# Altium schematic sheet TDS sensor 1.SchDoc
size A4; DocumentNumber: 4; SheetNumber: 4; SheetTotal: 4
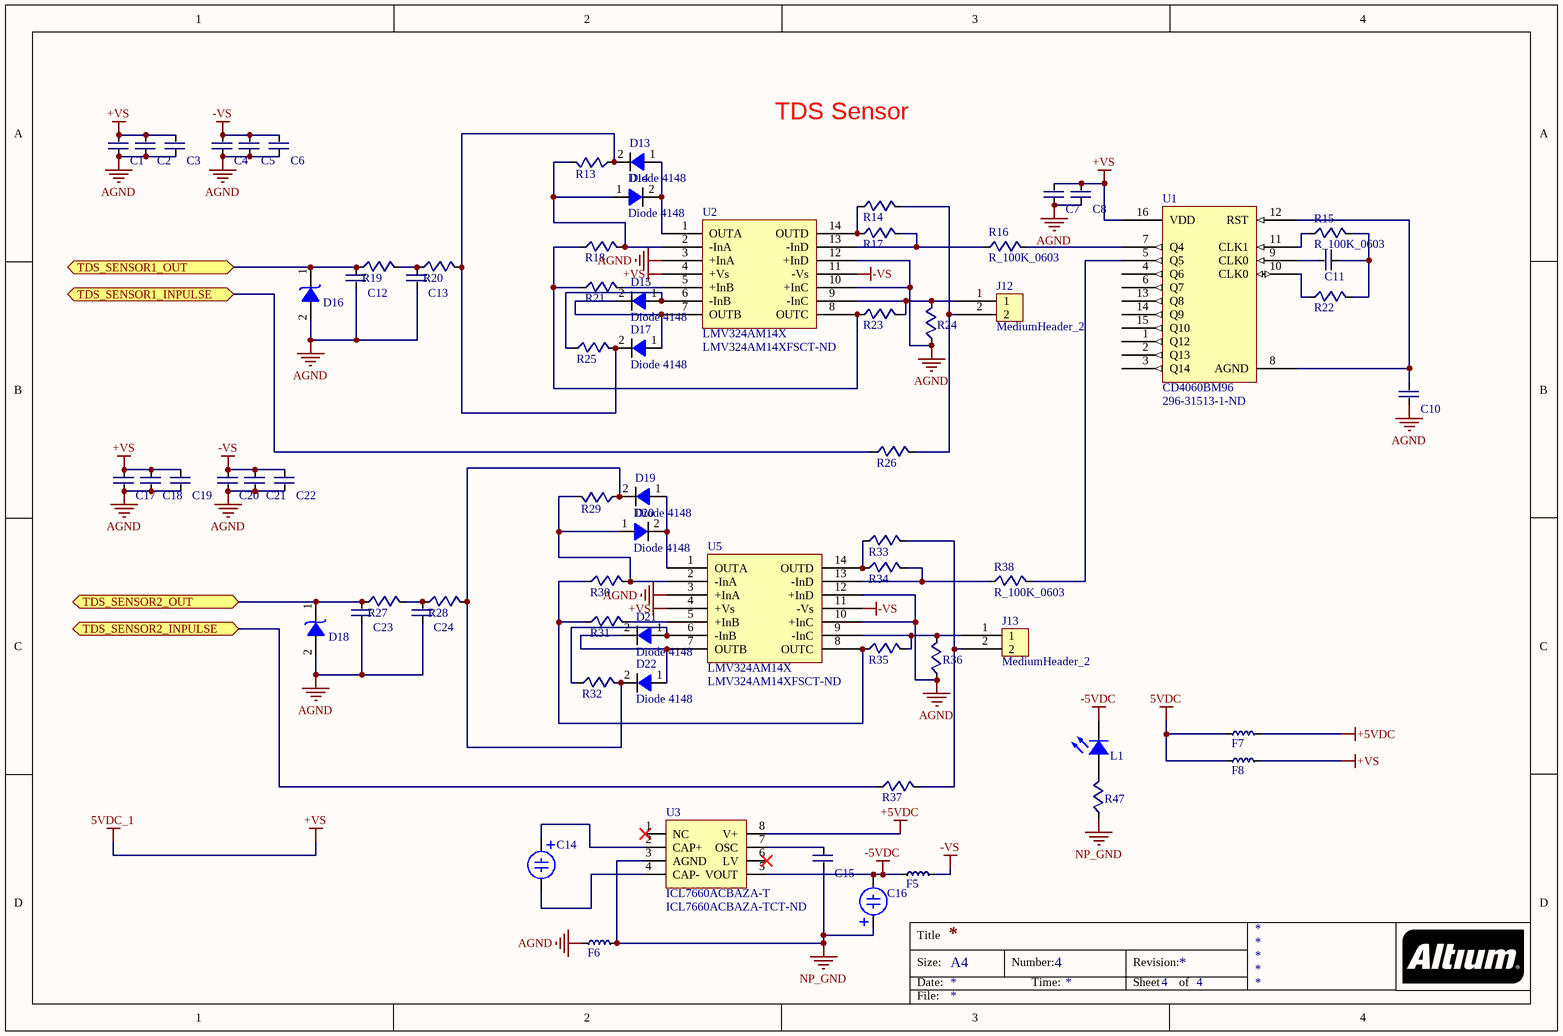
[diagram p0: TDS sensor 1.SchDoc]

## Parts
C1  100n Cer  [CN-SMD-0805]  (value not drawn)
C2  1n Cer  [CN-SMD-0805]  (value not drawn)
C3  10n Cer  [CN-SMD-0805]  (value not drawn)
C4  100n Cer  [CN-SMD-0805]  (value not drawn)
C5  1n Cer  [CN-SMD-0805]  (value not drawn)
C6  10n Cer  [CN-SMD-0805]  (value not drawn)
C7  10n Cer  [CN-SMD-0805]  (value not drawn)
C8  100n Cer  [CN-SMD-0805]  (value not drawn)
C10  100n Cer  [CN-SMD-0805]  (value not drawn)
C11  1n Cer  [CN-SMD-0805]  (value not drawn)
C12  10u Cer  [CN-SMD-0805]  (value not drawn)
C13  10u Cer  [CN-SMD-0805]  (value not drawn)
C14  CAP ALUM 100UF 25V 20% SMDL  [CAPALU_SM_5.3x5.3]  (value not drawn)
C15  100n Cer  [CN-SMD-0805]  (value not drawn)
C16  CAP ALUM 100UF 25V 20% SMDL  [CAPALU_SM_5.3x5.3]  (value not drawn)
C17  100n Cer  [CN-SMD-0805]  (value not drawn)
C18  1n Cer  [CN-SMD-0805]  (value not drawn)
C19  10n Cer  [CN-SMD-0805]  (value not drawn)
C20  100n Cer  [CN-SMD-0805]  (value not drawn)
C21  1n Cer  [CN-SMD-0805]  (value not drawn)
C22  10n Cer  [CN-SMD-0805]  (value not drawn)
C23  10u Cer  [CN-SMD-0805]  (value not drawn)
C24  10u Cer  [CN-SMD-0805]  (value not drawn)
D13  Diode 4148  [CD3216-1206]
D14  Diode 4148  [CD3216-1206]
D15  Diode 4148  [CD3216-1206]
D16  Diode_SS34  [DO-214AB_MOD_EXT]  (value not drawn)
D17  Diode 4148  [CD3216-1206]
D18  Diode_SS34  [DO-214AB_MOD_EXT]  (value not drawn)
D19  Diode 4148  [CD3216-1206]
D20  Diode 4148  [CD3216-1206]
D21  Diode 4148  [CD3216-1206]
D22  Diode 4148  [CD3216-1206]
F5  FBFB0805  [RESC_0603]  (value not drawn)
F6  FBFB0805  [RESC_0603]  (value not drawn)
F7  FBFB0805  [RESC_0603]  (value not drawn)
F8  FBFB0805  [RESC_0603]  (value not drawn)
J12  MediumHeader_2  [Medium - Header 2]
J13  MediumHeader_2  [Medium - Header 2]
L1  LTST-C171KRKT  [LED_0805]  (value not drawn)
R13  R_10K_0603  [RES-SMD-0603]  (value not drawn)
R14  R_0R_0603  [RES-SMD-0603]  (value not drawn)
R15  R_100K_0603  [RES-SMD-0603]
R16  R_100K_0603  [RES-SMD-0603]
R17  R_4K99_0603  [RES-SMD-0603]  (value not drawn)
R18  R_10K_0603  [RES-SMD-0603]  (value not drawn)
R19  R_10K_0603  [RES-SMD-0603]  (value not drawn)
R20  R_10K_0603  [RES-SMD-0603]  (value not drawn)
R21  R_10K_0603  [RES-SMD-0603]  (value not drawn)
R22  R_10K_0603  [RES-SMD-0603]  (value not drawn)
R23  R_4K99_0603  [RES-SMD-0603]  (value not drawn)
R24  R_1M_0603  [RES-SMD-0603]  (value not drawn)
R25  R_10K_0603  [RES-SMD-0603]  (value not drawn)
R26  R_0R_0603  [RES-SMD-0603]  (value not drawn)
R27  R_10K_0603  [RES-SMD-0603]  (value not drawn)
R28  R_10K_0603  [RES-SMD-0603]  (value not drawn)
R29  R_10K_0603  [RES-SMD-0603]  (value not drawn)
R30  R_10K_0603  [RES-SMD-0603]  (value not drawn)
R31  R_10K_0603  [RES-SMD-0603]  (value not drawn)
R32  R_10K_0603  [RES-SMD-0603]  (value not drawn)
R33  R_0R_0603  [RES-SMD-0603]  (value not drawn)
R34  R_4K99_0603  [RES-SMD-0603]  (value not drawn)
R35  R_4K99_0603  [RES-SMD-0603]  (value not drawn)
R36  R_1M_0603  [RES-SMD-0603]  (value not drawn)
R37  R_0R_0603  [RES-SMD-0603]  (value not drawn)
R38  R_100K_0603  [RES-SMD-0603]
R47  R_560R_0603  [RES-SMD-0603]  (value not drawn)
U1  CD4060BM96  Supplier Part Number 1: 296-31513-1-ND  [SOIC_16]
U2  LMV324AM14X  Supplier Part Number 1: LMV324AM14XFSCT-ND  [SOIC-14]
U3  ICL7660ACBAZA-T  Supplier Part Number 1: ICL7660ACBAZA-TCT-ND  [SOIC-8_MOD_24LC128]
U5  LMV324AM14X  Supplier Part Number 1: LMV324AM14XFSCT-ND  [SOIC-14]

## Ports
TDS_SENSOR1_INPULSE, TDS_SENSOR1_OUT, TDS_SENSOR2_INPULSE, TDS_SENSOR2_OUT

## Nets
5VDC: F7.1 F8.1
+5VDC: F7.2 U3.8(V+)
+VS: C1.2 C2.2 C3.2 C7.2 C8.2 C17.2 C18.2 C19.2 F8.2 U1.16(VDD) U2.4(+Vs) U5.4(+Vs)  [also labelled 5VDC_1]
-5VDC: C16.2 F5.1 L1.2(K) U3.5(VOUT)
-VS: C4.2 C5.2 C6.2 C20.2 C21.2 C22.2 F5.2 U2.11(-Vs) U5.11(-Vs)
AGND: C1.1 C2.1 C3.1 C4.1 C5.1 C6.1 C7.1 C8.1 C10.1 C12.1 C13.1 C17.1 C18.1 C19.1 C20.1 C21.1 C22.1 C23.1 C24.1 D16.2 D18.2 F6.1 R24.1 R36.1 U2.3(+InA) U2.10(+InC) U2.12(+InD) U5.3(+InA) U5.10(+InC) U5.12(+InD)
NP_GND: C15.1 C16.1 F6.2 R47.1 U3.3(AGND)
TDS_SENSOR1_INPULSE: R26.1 ; port TDS_SENSOR1_INPULSE
TDS_SENSOR1_OUT: C12.2 D16.1 R19.1 ; port TDS_SENSOR1_OUT
TDS_SENSOR2_INPULSE: R37.1 ; port TDS_SENSOR2_INPULSE
TDS_SENSOR2_OUT: C23.2 D18.1 R27.1 ; port TDS_SENSOR2_OUT
NetC10_2: C10.2 U1.8(AGND) U1.12(RST)
NetC11_1: C11.1 U1.9(CLK0)
NetC11_2: C11.2 R15.2 R22.2
NetC13_2: C13.2 R19.2 R20.1
NetC14_1: C14.1 U3.2(CAP+)
NetC14_2: C14.2 U3.4(CAP-)
NetC15_2: C15.2 U3.7(OSC)
NetC24_2: C24.2 R27.2 R28.1
NetD13_1: D13.1 D14.2 U2.1(OUTA)
NetD13_2: D13.2 D17.2 R13.1 R20.2 R25.2
NetD14_1: D14.1 R13.2 R18.2 U2.2(-InA)
NetD15_1: D15.1 R25.1 U2.6(-InB)
NetD15_2: D15.2 D17.1 U2.7(OUTB)
NetD19_1: D19.1 D20.2 U5.1(OUTA)
NetD19_2: D19.2 D22.2 R28.2 R29.1 R32.2
NetD20_1: D20.1 R29.2 R30.2 U5.2(-InA)
NetD21_1: D21.1 R32.1 U5.6(-InB)
NetD21_2: D21.2 D22.1 U5.7(OUTB)
NetJ12_1: J12.1 R23.2 R24.2 U2.9(-InC)
NetJ12_2: J12.2 R14.2 R26.2
NetJ13_1: J13.1 R35.2 R36.2 U5.9(-InC)
NetJ13_2: J13.2 R33.2 R37.2
NetL1_1: L1.1(A) R47.2
NetR14_1: R14.1 R17.1 U2.14(OUTD)
NetR15_1: R15.1 U1.11(CLK1)
NetR16_1: R16.1 R17.2 U2.13(-InD)
NetR16_2: R16.2 U1.7(Q4)
NetR18_1: R18.1 R21.1 R23.1 U2.8(OUTC)
NetR21_2: R21.2 U2.5(+InB)
NetR22_1: R22.1 U1.10(CLK0)
NetR30_1: R30.1 R31.1 R35.1 U5.8(OUTC)
NetR31_2: R31.2 U5.5(+InB)
NetR33_1: R33.1 R34.1 U5.14(OUTD)
NetR34_2: R34.2 R38.1 U5.13(-InD)
NetR38_2: R38.2 U1.5(Q5)

Not connected (* = marked no-connect by the designer): U1 1(Q12) 2(Q13) 3(Q14) 4(Q6) 6(Q7) 13(Q8) 14(Q9) 15(Q10); U3 1(NC)* 6(LV)*

## Notes on the sheet
- TDS Sensor
- Title
- Size:
- Date:
- A4
- Number:
- Time:
- Revision:
- Sheet
- of
- File:

## Library data of the parts
C1 C4 C8 C10 C15 C17 C20 = CAPC0805_104: CAP CER 0.1UF 25V 10% X7R 0805; Supplier 1: Digi-Key; Supplier Part Number 1: 399-1168-2-ND
C2 C5 C11 C18 C21 = CAPC0805_102: CAP CER 1000PF 50V 10% X7R 0805; Supplier 1: Digi-Key; Supplier Part Number 1: 399-1147-1-ND
C3 C6 C7 C19 C22 = CAPC0805_103: CAP CER 10000PF 100V X7R 0805; Supplier 1: Digi-Key; Supplier Part Number 1: 399-1159-1-ND
C12 C13 C23 C24 = CAPC0805_106: CAP CER 10UF 6.3V 10% X7R 0805; Supplier 1: Digi-Key; Supplier Part Number 1: 587-2780-2-ND
C14 C16 = CAPALU100U25V: CAP ALUM 100UF 25V 20% SMD; Supplier 1: Digi-Key; Supplier Part Number 1: 493-2113-1-ND
D13-D15 D17 D19-D22 = Diode_4148: DIODE SWITCHING 75V 0.2A LLDS; Supplier 1: Digi-Key; Supplier Part Number 1: 568-1749-1-ND
D16 D18 = Diode_SS34: DIODE SCHOTTKY 40V 3A SMC; Supplier 1: Digi-Key; Supplier Part Number 1: SS34FSCT-ND
F5-F8 = FB0603_1000Ohm: FERRITE BEAD 1000 OHM 0603; Supplier 1: Digi-Key; Supplier Part Number 1: 587-1867-1-ND
L1 = LED0805_RED: LED RED CLEAR 0805 SMD; Manufacturer: Generic Components; Class: Optoelectronic; Published: 08/06/2000; Publisher: Altium Hobart Technology Centre; SubClass: LED; Supplier 1: Digi-Key; Supplier Part Number 1: 160-1427-1-ND
R13 R18-R22 R25 R27-R32 = RES0603_10K: RES 10.0K OHM 1/10W 1% 0603 SMD; Supplier 1: Digi-Key; Supplier Part Number 1: 311-10.0KHRCT-ND
R14 R26 R33 R37 = RES0603_0R: RES 0.0 OHM 1/10W JUMP 0603 SMD; Supplier 1: Digi-Key; Supplier Part Number 1: 311-0.0GRDKR-ND
R15 R16 R38 = RES0603_100K: RES 100K OHM 1/10W 1% 0603 SMD; Supplier 1: Digi-Key; Supplier Part Number 1: 311-1.50KHRDKR-ND
R17 R23 R34 R35 = RES0603_4K99: RES 4.99K OHM 1/10W 1% 0603 SMD; Supplier 1: Digi-Key; Supplier Part Number 1: P4.99KHDKR-ND
R24 R36 = RES0603_1M: RES 1M OHM 1/8W 1% 0603 SMD; Supplier 1: Digi-Key; Supplier Part Number 1: 311-1.50KHRDKR-ND
R47 = RES0603_560R: RES 560 OHM 1/10W 0603 SMD; Supplier 1: Digi-Key; Supplier Part Number 1: 311-560HRTR-ND
U1 = CD4060BM: IC BINARY COUNTER/DIV/OSC 16SOIC; Supplier 1: Digi-Key
U2 U5 = LMV324A: IC OPAMP VFB 1.4MHZ RRO 14SOIC; Supplier 1: Digi-Key
U3 = ICL7660: IC REG SWTCHD CAP INV 45MA 8SOIC; Creator: Nguyen Ba Bien; Supplier 1: Digi-Key